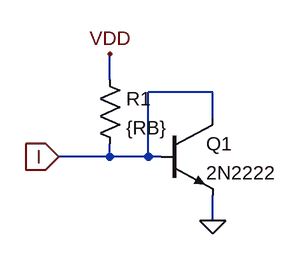
[diagram p0: schematic iilout.asc]
iilout.asc, the LTspice schematic file:
Version 4
SHEET 1 880 680
WIRE 48 208 48 176
WIRE 176 224 96 224
WIRE 176 256 176 224
WIRE 48 304 48 288
WIRE 48 304 -16 304
WIRE 96 304 96 224
WIRE 96 304 48 304
WIRE 112 304 96 304
WIRE 176 384 176 352
FLAG 176 384 0
FLAG 48 176 VDD
FLAG -16 304 I
IOPIN -16 304 In
SYMBOL npn 112 256 R0
SYMATTR InstName Q1
SYMATTR Value 2N2222
SYMBOL res 32 192 R0
SYMATTR InstName R1
SYMATTR Value {RB}

The netlist it stands for:
* iilout.asc
Q1 I I 0 0 2N2222
R1 VDD I {RB}
.model NPN NPN
.model PNP PNP
.lib standard.bjt
.backanno
.end